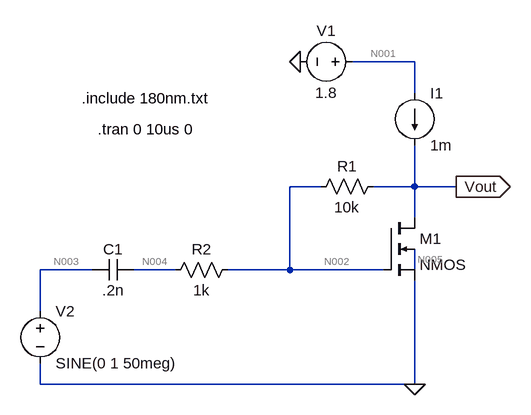
[diagram p0: schematic Draft8.asc]
Draft8.asc, the LTspice schematic file:
Version 4
SHEET 1 880 680
WIRE 288 -112 192 -112
WIRE 288 -64 288 -112
WIRE 144 80 96 80
WIRE 288 80 288 16
WIRE 288 80 224 80
WIRE 352 80 288 80
WIRE 288 128 288 80
WIRE -208 208 -288 208
WIRE -80 208 -144 208
WIRE 96 208 96 80
WIRE 96 208 0 208
WIRE 240 208 96 208
WIRE 288 208 288 176
WIRE -288 272 -288 208
WIRE -288 384 -288 352
WIRE 288 384 288 224
WIRE 288 384 -288 384
FLAG 112 -112 0
FLAG 352 80 Vout
IOPIN 352 80 Out
FLAG 288 384 0
SYMBOL nmos4 240 128 R0
SYMATTR InstName M1
SYMATTR Value2 l=.18u w=45u
SYMBOL res 128 96 R270
WINDOW 0 32 56 VTop 2
WINDOW 3 0 56 VBottom 2
SYMATTR InstName R1
SYMATTR Value 10k
SYMBOL current 288 -64 R0
WINDOW 123 0 0 Left 2
WINDOW 39 0 0 Left 2
SYMATTR InstName I1
SYMATTR Value 1m
SYMBOL voltage 208 -112 R90
WINDOW 0 -32 56 VBottom 2
WINDOW 3 32 56 VTop 2
WINDOW 123 0 0 Left 2
WINDOW 39 0 0 Left 2
SYMATTR InstName V1
SYMATTR Value 1.8
SYMBOL res -96 224 R270
WINDOW 0 32 56 VTop 2
WINDOW 3 0 56 VBottom 2
SYMATTR InstName R2
SYMATTR Value 1k
SYMBOL cap -208 224 R270
WINDOW 0 32 32 VTop 2
WINDOW 3 0 32 VBottom 2
SYMATTR InstName C1
SYMATTR Value .2n
SYMBOL voltage -288 256 R0
WINDOW 123 0 0 Left 2
WINDOW 39 0 0 Left 2
SYMATTR InstName V2
SYMATTR Value SINE(0 1 50meg)
TEXT -224 -56 Left 2 !.include 180nm.txt
TEXT -200 -8 Left 2 !.tran 0 10us 0

The netlist it stands for:
* Draft8.asc
M1 Vout N002 0 N005 NMOS l=.18u w=45u
R1 N002 Vout 10k
I1 N001 Vout 1m
V1 N001 0 1.8
R2 N004 N002 1k
C1 N003 N004 .2n
V2 N003 0 SINE(0 1 50meg)
.model NMOS NMOS
.model PMOS PMOS
.lib standard.mos
.include 180nm.txt
.tran 0 10us 0
.backanno
.end

* Results of the author's LTspice run, read from the files saved beside the schematic
* Operating Point, zero values left out:
*   V(vout) = 514.2 mV
*   V(n002) = 514.2 mV
*   V(n005) = 85.86 mV
*   V(n001) = 1.8 V
*   V(n004) = 514.2 mV
*   Id(M1) = 1 mA
*   Is(M1) = -1 mA
*   I(I1) = 1 mA
*   I(V1) = -1 mA
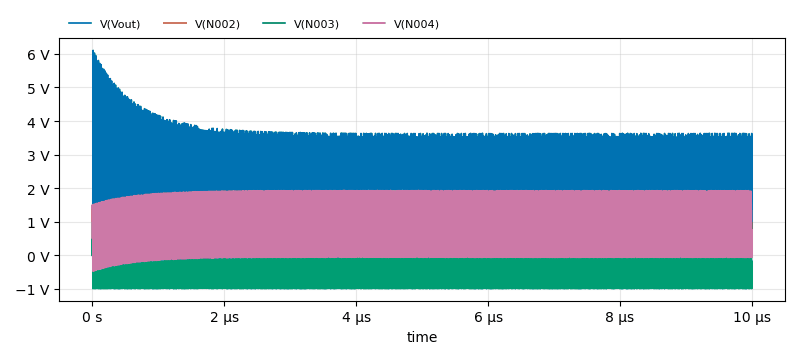
[diagram p1: Transient Analysis of Draft8.asc, plotted from the saved traces]
* Transient Analysis, 1 run:
*   V(Vout): min 17.63 mV, max 6.106 V, average 982.4 mV, rms 1.715 V, last 30.63 mV
*   V(N002): min 123.5 mV, max 1.757 V, average 909.8 mV, rms 1.057 V, last 828.7 mV
*   V(N003): min -997.6 mV, max 997.6 mV, average -4.157 mV, rms 700.8 mV, last 0 V
*   V(N004): min -477.1 mV, max 1.932 V, average 902.6 mV, rms 1.145 V, last 934.1 mV